# EAGLE schematic ArduinoProMini_IOShield (EAGLE 8.3.2)
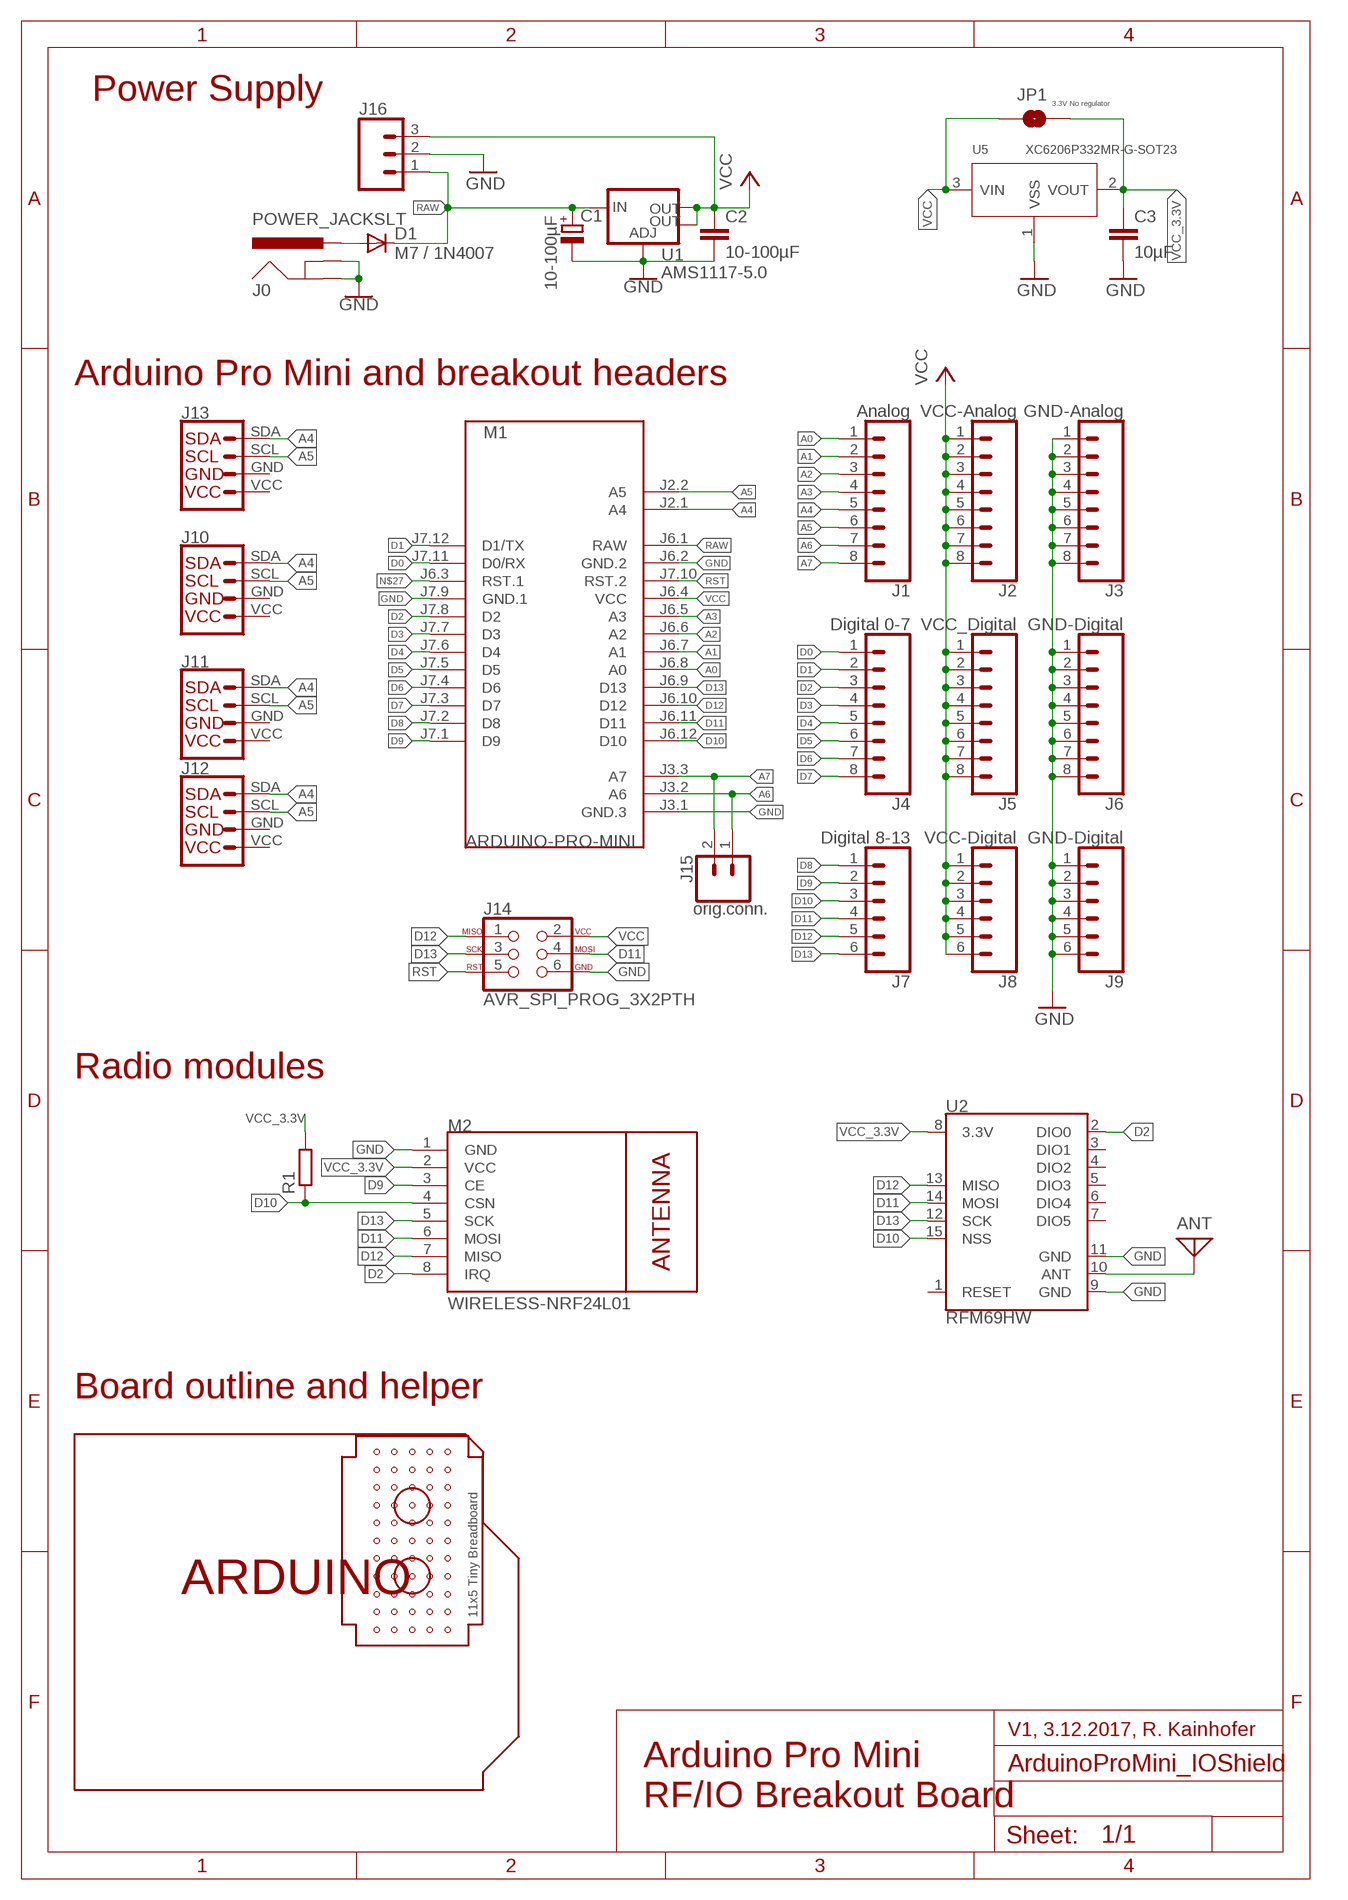
[diagram p0: schematic, sheet 1]

## Parts
ANT  ANTENNA  [PAD-01]
B1  ARDUINO_DIMENSION-DIMENSION  [ARDUINOR3]
C1  10-100µF  CPOL-EU153CLV-0605  [153CLV-0605]
C2  10-100µF  C-EUC0805  [C0805]
C3  10µF  C-EUC0805  [C0805]
D1  M7 / 1N4007  DIODE-DO-214AC  [DO-214AC]
J0  POWER_JACKSLT  [POWER_JACK_SLOT]
J1  Analog  CONN_08"  [1X08]
J2  VCC-Analog  CONN_08"  [1X08]
J3  GND-Analog  CONN_08"  [1X08]
J4  Digital 0-7  CONN_08"  [1X08]
J5  VCC_Digital  CONN_08"  [1X08]
J6  GND-Digital  CONN_08"  [1X08]
J7  Digital 8-13  CONN_06SILK_FEMALE_PTH  [1X06]
J8  VCC-Digital  CONN_06SILK_FEMALE_PTH  [1X06]
J9  GND-Digital  CONN_06SILK_FEMALE_PTH  [1X06]
J10  I2C_CONN_VGLA  [1X04]
J11  I2C_CONN_VGLA  [1X04]
J12  I2C_CONN_VGLA  [1X04]
J13  I2C_CONN_VGLA  [1X04]
J14  AVR_SPI_PROG_3X2PTH  [2X3]
J15  orig.conn.  CONN_02  [1X02]
J16  CONN_031X03_NO_SILK  [1X03_NO_SILK]
JP1  3.3V No regulator  JUMPER-SMT_2_NO_SILK  [SMT-JUMPER_2_NO_SILK]
M1  ARDUINO-PRO-MINI  ARDUINO-PRO-MINI-3.3V#NP  [ARDUINO-PRO-MINI#NP]
M2  WIRELESS-NRF24L01  [WIRELESS-NRF24L01]
R1  R-EU_R0805  [R0805]
U1  AMS1117-5.0  V_REG_LM1117SOT223  [SOT223]
U2  RFM69HW  [RFM69W-XXXS2]
U5  XC6206P332MR-G-SOT23  PMIC-LDO-XC6206P332MR-G(SOT23)  [SOT-23]
U$1  MINI_BREADBOARD  [MINI_BREADBOARD_11X5]

## Nets
A0: J1.1 M1.J6.8(A0)
A1: J1.2 M1.J6.7(A1)
A2: J1.3 M1.J6.6(A2)
A3: J1.4 M1.J6.5(A3)
A4: J1.5 J10.SDA J11.SDA J12.SDA J13.SDA M1.J2.1(A4)
A5: J1.6 J10.SCL J11.SCL J12.SCL J13.SCL M1.J2.2(A5)
A6: J1.7 J15.1 M1.J3.2(A6)
A7: J1.8 J15.2 M1.J3.3(A7)
D0: J4.1 M1.J7.11(D0/RX)
D1: J4.2 M1.J7.12(D1/TX)
D2: J4.3 M1.J7.8(D2) M2.8(IRQ) U2.2(DIO0)
D3: J4.4 M1.J7.7(D3)
D4: J4.5 M1.J7.6(D4)
D5: J4.6 M1.J7.5(D5)
D6: J4.7 M1.J7.4(D6)
D7: J4.8 M1.J7.3(D7)
D8: J7.1 M1.J7.2(D8)
D9: J7.2 M1.J7.1(D9) M2.3(CE)
D10: J7.3 M1.J6.12(D10) M2.4(CSN) R1.1 U2.15(NSS)
D11: J7.4 J14.4 M1.J6.11(D11) M2.6(MOSI) U2.14(MOSI)
D12: J7.5 J14.1 M1.J6.10(D12) M2.7(MISO) U2.13(MISO)
D13: J7.6 J14.3 M1.J6.9(D13) M2.5(SCK) U2.12(SCK)
GND: C1.- C2.2 C3.2 J0.GND@1(GNDBREAK) J0.GND@2(GND) J3.1 J3.2 J3.3 J3.4 J3.5 J3.6 J3.7 J3.8 J6.1 J6.2 J6.3 J6.4 J6.5 J6.6 J6.7 J6.8 J9.1 J9.2 J9.3 J9.4 J9.5 J9.6 J14.6 J16.2 M1.J3.1(GND.3) M1.J6.2(GND.2) M1.J7.9(GND.1) M2.1(GND) U1.1(ADJ) U2.9(GND) U2.11(GND) U5.1(VSS)
N$1: D1.A J0.PWR
N$23: ANT.1 U2.10(ANT)
N$27: M1.J6.3(RST.1)
RAW: C1.+ D1.C J16.1 M1.J6.1(RAW) U1.3(IN)
RST: J14.5 M1.J7.10(RST.2)
VCC: C2.1 J2.1 J2.2 J2.3 J2.4 J2.5 J2.6 J2.7 J2.8 J5.1 J5.2 J5.3 J5.4 J5.5 J5.6 J5.7 J5.8 J8.1 J8.2 J8.3 J8.4 J8.5 J8.6 J14.2 J16.3 JP1.1 M1.J6.4(VCC) U1.2(OUT) U1.4(OUT) U5.3(VIN)
VCC_3.3V: C3.1 JP1.2 M2.2(VCC) R1.2 U2.8(3.3V) U5.2(VOUT)
Unconnected: U2.1(RESET) U2.3(DIO1) U2.4(DIO2) U2.5(DIO3) U2.6(DIO4) U2.7(DIO5)

## Notes on the sheet
- Power Supply
- Arduino Pro Mini and breakout headers
- Radio modules
- Board outline and helper
- V1, 3.12.2017, R. Kainhofer
- Arduino Pro Mini 
  RF/IO Breakout Board

## Power pins joined to a net without a drawn wire
GND: J10.GND J11.GND J12.GND J13.GND
VCC: J10.VCC J11.VCC J12.VCC J13.VCC

## Library data of the parts
ANT = discrete:ANTENNA: Antenna
B1 = opentools:ARDUINO_DIMENSION: Arduino R3 outline for shields or other PCBs that are supposed to fit the same space as an Arduino.
C1 = resistor:CPOL-EU: POLARIZED CAPACITOR, European symbol
C2 C3 = resistor:C-EU: CAPACITOR, European symbol
D1 = diode:DIODE-: DIODE
J0 = SparkFun-Connectors:POWER_JACK: Power Jack Connector This is the standard 5.5mm barrel jack for power. The PTH is the most common, proven, reliable, footprint. The Slot footprint only works if the mill layer is transmitted to the PCB fab house so be warned. Here are the connectors we sell at SparkFun: DC Barrel Power Jack/Connector <https://www.sparkfun.com/products/119> (PRT-00119) DC Barrel Power Jack/Connector (SMD) <https://www.sparkfun.com/products/12748> (PRT-12748) DC Barrel Jack Adapter - Breadboard Compatible <https://www.sparkfun.com/products/10811> (PRT-10811) It is used on this SparkFun product (and many, many others): SparkFun RedBoard - Programmed with Arduino <https://www.sparkfun.com/products/12757> (DEV-12757) Also, if you need a mating power supply or connector, please check these out: Wall Adapter Power Supply - 9VDC 650mA <https://www.sparkfun.com/products/298> (TOL-00298) DC Barrel Jack Adapter - Male <https://www.sparkfun.com/products/10287> (PRT-10287); PROD_ID: PRT-00119
J1-J6 = SparkFun-Connectors:CONN_08: Multi connection point. Often used as Generic Header-pin footprint for 0.1 inch spaced/style header connections On any of the 0.1 inch spaced packages, you can populate with these: Break Away Headers - Straight <https://www.sparkfun.com/products/116> (PRT-00116) Break Away Male Headers - Right Angle <https://www.sparkfun.com/products/553> (PRT-00553) Female Headers <https://www.sparkfun.com/products/115> (PRT-00115) Break Away Headers - Machine Pin <https://www.sparkfun.com/products/117> (PRT-00117) Break Away Female Headers - Swiss Machine Pin <https://www.sparkfun.com/products/743> (PRT-00743) Arduino Stackable Header - 8 Pin <https://www.sparkfun.com/products/9279> (PRT-09279) For SCREWTERMINALS and SPRING TERMINALS visit here: Screw Terimnals on SparkFun.com <https://www.sparkfun.com/search/results?term=Screw+Terminals> (5mm/3.5mm/2.54mm spacing) This device is also useful as a general connection point to wire up your design to another part of your project. Our various solder wires solder well into these plated through hole pads. Hook-Up Wire - Assortment (Stranded, 22 AWG) <https://www.sparkfun.com/products/11375> (PRT-11375) Hook-Up Wire - Assortment (Solid Core, 22 AWG) <https://www.sparkfun.com/products/11367> (PRT-11367) View the entire wire category on our website here <https://www.sparkfun.com/categories/141> Special notes: Molex polarized connector foot print use with SKU : PRT-08231 with associated crimp pins and housings. 1MM SMD Version SKU: PRT-10208 NOTES ON THE VARIANTS LOCK and LOCK_LONGPADS... This footprint was designed to help hold the alignment of a through-hole component (i.e. 6-pin header) while soldering it into place. You may notice that each hole has been shifted either up or down by 0.005 of an inch from it's more standard position (which is a perfectly straight line). This slight alteration caused the pins (the squares in the middle) to touch the edges of the holes. Because they are alternating, it causes a "brace" to hold the component in place. 0.005 has proven to be the perfect amount of "off-center" position when using our standard breakaway headers. Although looks a little odd when you look at the bare footprint, once you have a header in there, the alteration is very hard to notice. Also,if you push a header all the way into place, it is covered up entirely on the bottom side.; PROD_ID: CONN-08438
J7-J9 = SparkFun-Connectors:CONN_06: Multi connection point. Often used as Generic Header-pin footprint for 0.1 inch spaced/style header connections On any of the 0.1 inch spaced packages, you can populate with these: Break Away Headers - Straight <https://www.sparkfun.com/products/116> (PRT-00116) Break Away Male Headers - Right Angle <https://www.sparkfun.com/products/553> (PRT-00553) Female Headers <https://www.sparkfun.com/products/115> (PRT-00115) Break Away Headers - Machine Pin <https://www.sparkfun.com/products/117> (PRT-00117) Break Away Female Headers - Swiss Machine Pin <https://www.sparkfun.com/products/743> (PRT-00743) Arduino Stackable Header - 6 Pin <https://www.sparkfun.com/products/9280> (PRT-09280) For SCREWTERMINALS and SPRING TERMINALS visit here: Screw Terimnals on SparkFun.com <https://www.sparkfun.com/search/results?term=Screw+Terminals> (5mm/3.5mm/2.54mm spacing) This device is also useful as a general connection point to wire up your design to another part of your project. Our various solder wires solder well into these plated through hole pads. Hook-Up Wire - Assortment (Stranded, 22 AWG) <https://www.sparkfun.com/products/11375> (PRT-11375) Hook-Up Wire - Assortment (Solid Core, 22 AWG) <https://www.sparkfun.com/products/11367> (PRT-11367) View the entire wire category on our website here <https://www.sparkfun.com/categories/141>; PROD_ID: CONN-08437
J10-J13 = opentools:I2C_CONN_VGLA: I2C Standard Pinout Header Standardized pinout for all I2C based sensor breakouts. This pinout allows I2C boards to be plugged directly into the headers on Arduino Uno compatible boards, and to be daisy chained easily. The order of the I2C pins is: VCC GND SCL SDA
J14 = SparkFun-Connectors:AVR_SPI_PROG_3X2: AVR ISP 6 Pin This is the reduced ISP connector for AVR programming. Common on Arduino. This footprint will take up less PCB space and can be used with a 10-pin to 6-pin adapter such as SKU: BOB-08508 **Special note about "TEST_POINT" package. The stop mask is on the top side, so if you want your programming test points to be on the bottom of your board, make sure to place this package on the bottom side of the board. This also ensure that the orientation to program from the bottom side will be correct. SparkFun Products: SparkFun ISP Pogo Adapter <https://www.sparkfun.com/products/11591> - NS Tiny AVR Programmer <https://www.sparkfun.com/products/11801> -PTH
J15 = SparkFun-Connectors:CONN_02: Multi connection point. Often used as Generic Header-pin footprint for 0.1 inch spaced/style header connections On any of the 0.1 inch spaced packages, you can populate with these: Break Away Headers - Straight <https://www.sparkfun.com/products/116> (PRT-00116) Break Away Male Headers - Right Angle <https://www.sparkfun.com/products/553> (PRT-00553) Female Headers <https://www.sparkfun.com/products/115> (PRT-00115) Break Away Headers - Machine Pin <https://www.sparkfun.com/products/117> (PRT-00117) Break Away Female Headers - Swiss Machine Pin <https://www.sparkfun.com/products/743> (PRT-00743) For SCREWTERMINALS and SPRING TERMINALS visit here: Screw Terimnals on SparkFun.com <https://www.sparkfun.com/search/results?term=Screw+Terminals> (5mm/3.5mm/2.54mm spacing) This device is also useful as a general connection point to wire up your design to another part of your project. Our various solder wires solder well into these plated through hole pads. Hook-Up Wire - Assortment (Stranded, 22 AWG) <https://www.sparkfun.com/products/11375> (PRT-11375) Hook-Up Wire - Assortment (Solid Core, 22 AWG) <https://www.sparkfun.com/products/11367> (PRT-11367) View the entire wire category on our website here <https://www.sparkfun.com/categories/141> Special notes: Molex polarized connector foot print use with: PRT-08233 with associated crimp pins and housings. 2.54_SCREWTERM for use with PRT-10571. 3.5mm Screw Terminal footprints for PRT-08084 5mm Screw Terminal footprints for use with PRT-08432
J16 = SparkFun-Connectors:CONN_03: Multi connection point. Often used as Generic Header-pin footprint for 0.1 inch spaced/style header connections On any of the 0.1 inch spaced packages, you can populate with these: Break Away Headers - Straight <https://www.sparkfun.com/products/116> (PRT-00116) Break Away Male Headers - Right Angle <https://www.sparkfun.com/products/553> (PRT-00553) Female Headers <https://www.sparkfun.com/products/115> (PRT-00115) Break Away Headers - Machine Pin <https://www.sparkfun.com/products/117> (PRT-00117) Break Away Female Headers - Swiss Machine Pin <https://www.sparkfun.com/products/743> (PRT-00743) Stackable Header - 3 Pin (Female, 0.1") <https://www.sparkfun.com/products/13875> (PRT-13875) For SCREWTERMINALS and SPRING TERMINALS visit here: Screw Terimnals on SparkFun.com <https://www.sparkfun.com/search/results?term=Screw+Terminals> (5mm/3.5mm/2.54mm spacing) This device is also useful as a general connection point to wire up your design to another part of your project. Our various solder wires solder well into these plated through hole pads. Hook-Up Wire - Assortment (Stranded, 22 AWG) <https://www.sparkfun.com/products/11375> (PRT-11375) Hook-Up Wire - Assortment (Solid Core, 22 AWG) <https://www.sparkfun.com/products/11367> (PRT-11367) View the entire wire category on our website here <https://www.sparkfun.com/categories/141> Special notes: Molex polarized connector foot print use with SKU : PRT-08232 with associated crimp pins and housings.
JP1 = SparkFun-Jumpers:JUMPER-SMT_2_NO: Normally open jumper This jumper has two pads in close proximity to each other. Apply solder to close the connection. Round pads are easier to solder for beginners, but are a lot larger. SparkFun Product that uses the round pads: SparkFun EL Sequencer <https://www.sparkfun.com/products/12781>
M1 = diy-modules:ARDUINO-PRO-MINI-*#NP: Arduino Pro Mini (and compatible devices) without programming pads More details available here: https://www.arduino.cc/en/Main/ArduinoBoardProMini Click here to find device on ebay.com <http://www.ebay.com/sch/arduino+pro+mini>
M2 = diy-modules:WIRELESS-NRF24L01: 2.4 GHz Wireless Module based on NRF24L01 chip More details available here: http://www.electrodragon.com/w/NRF24L01 Click here to find device on ebay.com <http://www.ebay.com/sch/nrf24l01+arduino>
R1 = resistor:R-EU_: RESISTOR, European symbol
U1 = SparkFun-IC-Power:V_REG_LM1117: Voltage Regulator LM1117 Standard adjustable voltage regulator but in SMD form. Spark Fun Electronics SKU : COM-00595; PROD_ID: VREG-08170
U2 = SparkFun-RF:RFM69H: Hope RF RFM69H ISM Transceiver Module The RFM69H is a transceiver module capable of operation over a wide frequency range, including the 315,433,868 and 915MHz license-free ISM (Industry Scientific and Medical) frequency bands. All major RF communication parameters are programmable and most of them can be dynamically set. The RFM69H offers the unique advantage of programmable narrow-band and wide- band communication modes. The RFM69H is optimized for low power consumption while offering high RF output power and channelized operation.Compliance ETSI and FCC regulations. Datasheet <http://www.hoperf.cn/upload/docs/RF/SX/RFM69H_DataSheet_v1.3.pdf> SparkFun Products RFM69HCW Wireless Transceiver - 915MHz <https://www.sparkfun.com/products/13909> (COM-13909) RFM69HCW Wireless Transceiver - 434MHz <https://www.sparkfun.com/products/13910> (COM-13910) SparkFun RFM69 Breakout (915MHz) <https://www.sparkfun.com/products/12775> (WRL-12775) SparkFun RFM69 Breakout (434MHz) <https://www.sparkfun.com/products/12823> (WRL-12823)
U5 = Seeed-IC:PMIC-LDO-XC6206P332MR-G(SOT23): 310030099; MPN: XC6206P332MR-G
U$1 = opentools:MINI_BREADBOARD: 5x11 pin tiny breadboard with 2 nipples at the back for the Magic Breadboard Mama Board

## Net classes
0 default: width 0.305 mm, clearance 0.152 mm
1 GND: width 0.305 mm, clearance 0.152 mm